# Altium schematic sheet PowerIn.SchDoc
size A4
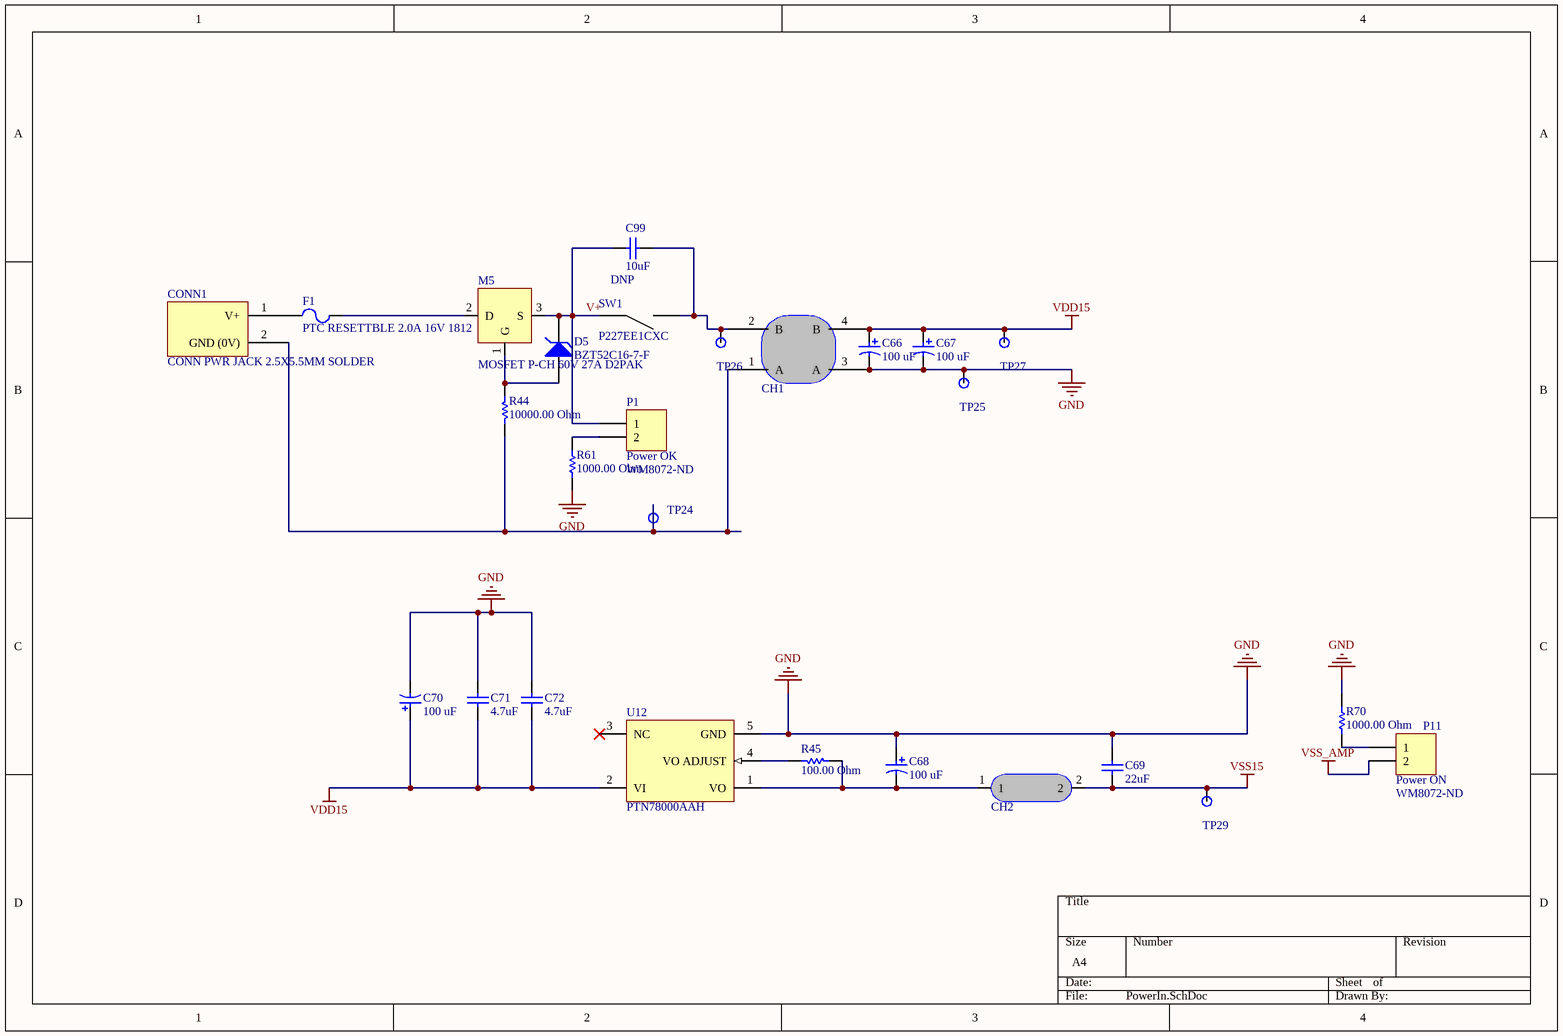
[diagram p0: PowerIn.SchDoc]

## Parts
C66  100 uF  [CAPPR55-250-1120X630X1220]
C67  100 uF  [CAPPR55-250-1120X630X1220]
C68  100 uF  [CAPPR55-250-1120X630X1220]
C69  value 22uF  [CAPC1206(3216)190_M]  (hidden comment: CAP 22uF 25V 1206(3216))
C70  100 uF  [CAPPR55-250-1120X630X1220]
C71  value 4.7uF  [CAPC0805(2012)145_L]  (hidden comment: CAP 4.7uF 25V 0805(2012))
C72  value 4.7uF  [CAPC0805(2012)145_L]  (hidden comment: CAP 4.7uF 25V 0805(2012))
C99  value 10uF  OPTION: DNP  [CAPC1206(3216)190_L]  (hidden comment: CAP 10uF 25V 1206(3216))
CH1  10uH 2.4A COMMON CHOKE  [10uH 2.4A COMMON CHOKE]  (value not drawn)
CH2  FIXED IND 10UH 5A 25 MOHM SMD  [FIXED IND 10UH 5A 190 MOHM SMD]  (value not drawn)
CONN1  CONN PWR JACK 2.5X5.5MM SOLDER  [CONN PWR JACK 2.5X5.5MM SOLDER]
D5  BZT52C16-7-F  [DIOD-SOD123-2_V]
F1  PTC RESETTBLE 2.0A 16V 1812  [TC RESETTBLE 2.0A 16V 1812]
M5  MOSFET P-CH 60V 27A D2PAK  [DPAK228P1525X483-3N]
P1  Power OK  Supplier Part Number 1: WM8072-ND  [HDR1X2]
P11  Power ON  Supplier Part Number 1: WM8072-ND  [HDR1X2]
R44  value 10000.00 Ohm  [RESC0603(1608)_N]  (hidden comment: 10K 5% 0603(1608))
R45  value 100.00 Ohm  [RESC0603(1608)_M]  (hidden comment: 100R 1% 0603(1608))
R61  value 1000.00 Ohm  [RESC0603(1608)_L]  (hidden comment: 1K 5% 0603(1608))
R70  value 1000.00 Ohm  [RESC0603(1608)_L]  (hidden comment: 1K 5% 0603(1608))
SW1  P227EE1CXC  [P227EE1CXC]
TP24  Testpoint  [0603 PROBE PAD]  (value not drawn)
TP25  Testpoint  [0603 PROBE PAD]  (value not drawn)
TP26  Testpoint  [0603 PROBE PAD]  (value not drawn)
TP27  Testpoint  [0603 PROBE PAD]  (value not drawn)
TP29  Testpoint  [0603 PROBE PAD]  (value not drawn)
U12  PTN78000AAH  [EUS0005A]

## Nets
GND: C66.2 C67.2 C68.1 C69.2 C70.2 C71.1 C72.1 CH1.3(A) R61.2 R70.1 TP25.0 U12.5(GND)
VDD15: C66.1 C67.1 C70.1 C71.2 C72.2 CH1.4(B) TP27.0 U12.2(VI)
VSS15: C69.1 CH2.2 TP29.0
VSS_AMP: P11.2
V+: C99.2 D5.2(K) M5.3(S) P1.1 SW1.1
NetC68_2: C68.2 CH2.1 R45.1 U12.1(VO)
NetC99_1: C99.1 CH1.2(B) SW1.2 TP26.0
NetCH1_1: CH1.1(A) CONN1.2(GND_(0V)) R44.1 TP24.0
NetCONN1_1: CONN1.1(V+) F1.1
NetD5_1: D5.1(A) M5.1(G) R44.2
NetF1_2: F1.2 M5.2(D)
NetP1_2: P1.2 R61.1
NetP11_1: P11.1 R70.2
NetR45_2: R45.2 U12.4(VO_ADJUST)

Not connected (* = marked no-connect by the designer): U12 3(NC)*

## Library data of the parts
C66-C68 C70 = CMP-1665-00015-4: Aluminum Electrolytic Capacitor (Radial Lead Type), 100 uF, 35 V, -40 to 85 degC, 2-Pin THD, RoHS, Bulk; Manufacturer: Panasonic; Voltage Rating: 35 V; PackageReference: Radial; ComponentLink2URL: http://industrial.panasonic.com/cdbs/www-data/pdf/RDF0000/ABA0000C1047.pdf; DatasheetVersion: 03/2016; REACH SVHC: No SVHC; Mounting Technology: Through Hole; ComponentLink2Description: Datasheet; Packaging: Bulk; Lead Pitch: 2.5 mm; Height: 11.2 mm; Pins: 2; RoHSCompliant: true; Mount: Through Hole; Package Quantity: 200; Min Operating Temperature: -40 degC; Max Operating Temperature: 85 degC; PackageDescription: 2-Pin Through Hole Device, Dia 6.3 mm, Body Length 11.2 mm; ComponentLink1Description: Manufacturer URL; Length: 11.2 mm; ComponentLink1URL: http://www.panasonic.com/
C69 = CMP-1037-04995-1: CAP 22uF 25V ±20% 1206 (3216 Metric) Thickness 1.9mm SMD; Case-EIA: 1206; Tolerance: Â±20%; Case-Metric: 3216; Rated Voltage: 25 V; Technology: SMT; Max Thickness: 1.9 mm; OrderURL: http://www.digikey.ie/product-detail/en/taiyo-yuden/TMK316BBJ226ML-T/587-3246-1-ND/3660105; Supplier Part Number 1: 587-3246-1-ND; Supplier 1: Digi-Key
C71 C72 = CMP-1036-04895-1: CAP 4.7uF 25V ±10% 0805 (2012 Metric) Thickness 1.45mm SMD; Case-Metric: 2012; Case-EIA: 0805; Tolerance: Â±10%; Technology: SMT; Rated Voltage: 25 V; Max Thickness: 1.45 mm
C99 = CMP-1037-04979-1: CAP 10uF 25V ±10% 1206 (3216 Metric) Thickness 1.9mm SMD; Case-EIA: 1206; Tolerance: Â±10%; Case-Metric: 3216; Rated Voltage: 25 V; Technology: SMT; Max Thickness: 1.9 mm; OrderURL: http://www.digikey.ie/product-detail/en/murata-electronics-north-america/GRM319R61E106KA12D/490-5525-1-ND/2334921; Supplier 1: Digi-Key; Supplier Part Number 1: 490-5525-1-ND
CH1 = 10uH 2.4A COMMON CHOKE: CMC 10UH 2.25A 2LN 9 KOHM SMD; Manufacturer: Wurth Electronics Inc.; Manufacturer Part Number: 744282100; Filter Type: Power, Signal Line; Number of Lines: 2; Impedance @ Frequency: 9 kOhm @ 100kHz; Inductance @ Frequency: 10µH @ 100kHz; DC Resistance (DCR) (Max): 50 mOhm; Voltage Rating - DC: 80V; Value: 1K; Published: 8-Jun-2000; LatestRevisionDate: 29-May-2009; LatestRevisionNote: IPC-7351 Footprint Added.; PackageReference: J1-0603; Publisher: Altium Limited; PackageDescription: Chip Resistor; RoHS: RoHS Compliant; Category: Filters; Packaging: Cut Tape (CT); Part Status: Active; Current Rating (Max): 2.25A; Voltage Rating - AC: -; Operating Temperature: -40°C ~ 125°C; Ratings: -; Approvals: -; Features: -; Mounting Type: Surface Mount; Size / Dimension: 0.492" L x 0.492" W (12.50mm x 12.50mm); Height (Max): 0.256" (6.50mm); Package / Case: Horizontal, 4 PC Pad; ComponentLink1URL: http://katalog.we-online.de/pbs/datasheet/744282100.pdf; ComponentLink1Description: http://katalog.we-online.de/pbs/datasheet/744282100.pdf; Supplier 1: Digi-Key; Supplier Part Number 1: 732-2966-1-ND; Stock 1: 0; Pricing 1: 1=3.82, 10=3.702, 50=3.3436, 100=3.2242, 250=2.9854 (EUR)
CH2 = 74477110: Manufacturer: Wurth Electronics Inc.; Material - Core: Ferrite; Inductance: 10µH; Tolerance: ±20%; Current - Saturation: 5.5A; Shielding: Shielded; DC Resistance (DCR): 25 mOhm Max; Frequency - Self Resonant: 21.5MHz; Frequency - Test: 1kHz; Value: 1K; Published: 8-Jun-2000; LatestRevisionDate: 29-May-2009; LatestRevisionNote: IPC-7351 Footprint Added.; PackageReference: J1-0603; Publisher: Altium Limited; PackageDescription: Chip Resistor; Manufacturer Part Number: 74477110; RoHS: RoHS Compliant; Category: Inductors, Coils, Chokes; Packaging: Cut Tape (CT); Part Status: Active; Type: Wirewound; Current Rating: 5A; Q @ Freq: -; Ratings: -; Operating Temperature: -40°C ~ 125°C; Mounting Type: Surface Mount; Package / Case: Nonstandard; Supplier Device Package: -; Size / Dimension: 0.472" L x 0.472" W (12.00mm x 12.00mm); Height - Seated (Max): 0.236" (6.00mm); ComponentLink1URL: http://katalog.we-online.de/pbs/datasheet/74477110.pdf; ComponentLink1Description: http://katalog.we-online.de/pbs/datasheet/74477110.pdf; Supplier 1: Digi-Key; Supplier Part Number 1: 732-1208-1-ND; Stock 1: 3817; Pricing 1: 1=2.82, 10=2.47, 50=2.2934, 100=2.2052, 250=2.11692 (EUR)
CONN1 = RAPC712X: Manufacturer: Switchcraft Inc.; Gender: Male; Industry Recognized Mating Diameter: 2.50mm ID (0.098"), 5.50mm OD (0.217"); Actual Diameter: 0.098" (2.50mm ID), 0.248" (6.30mm OD); Number of Positions/Contacts: 2 Conductors, 3 Contacts; Internal Switch(s): Single Switch, Normally Closed; Shielding: Unshielded; Current Rating: 5A; Includes: 1 pc - 1 Connector; Body Color: Black; Value: 1K; Published: 8-Jun-2000; LatestRevisionDate: 29-May-2009; LatestRevisionNote: IPC-7351 Footprint Added.; PackageReference: J1-0603; Publisher: Altium Limited; PackageDescription: Chip Resistor; Manufacturer Part Number: RAPC712X; RoHS: RoHS Compliant; Category: Connectors, Interconnects; Packaging: Bulk; Part Status: Active; Connector Type: Jack; Mounting Type: Through Hole, Right Angle; Mounting Feature: -; Termination: Solder Eyelet(s); Features: -; Insulation Color: -; Voltage - Rated: -; Mating Length/Depth: -; Contact Material - Plating: Silver; Body Material: -; Operating Temperature: -; Housing Material: Thermoplastic; Contact Material: Brass; Thread Size: -; Material Flammability Rating: -; Ingress Protection: -; ComponentLink1URL: http://www.switchcraft.com/Drawings/rapc712x_cd.pdf; ComponentLink1Description: http://www.switchcraft.com/Drawings/rapc712x_cd.pdf; Supplier 1: Digi-Key; Supplier Part Number 1: SC237-ND; Stock 1: 19155; Pricing 1: 1=0.85, 10=0.786, 25=0.7416, 50=0.719, 100=0.6852, 250=0.674, 500=0.6608 (EUR)
D5 = CMP-0860-00001-1: Surface Mount Zener Diode, 16 V, -65 to 125 degC, SOD123, RoHS, Tape and Reel; Manufacturer: Diodes Inc; Maximum Reverse Current: 0.1 uA; Tol V: 5.56% Typ.; Maximum Zener Impedance f: 1 kHz ZZK=200 Ohm; Voltage Zener: 16 V Typ.; Power Max: 500 mW; ComponentLink2URL: http://www.diodes.com/datasheets/ds18004.pdf; PackageDescription: 2-Pin SOD123, Body 2.7 x 1.55 mm, Height 1.45 mm; ComponentLink3Description: Package Specification; Mounting Technology: Surface Mount; PackageReference: SOD123; ComponentLink2Description: Datasheet; RoHS: TRUE; ComponentLink3URL: http://www.diodes.com/datasheets/ap02002.pdf; Operating Temperature: -65 to 150 degC; DatasheetVersion: Rev. 37-2; Packing: Tape and Reel; ComponentLink1Description: Manufacturer URL; ComponentLink1URL: http://www.diodes.com/; PackageVersion: Rev. 79; PartNumber: BZT52C16-7-F
F1 = TC RESETTBLE 2.0A 16V 1812: Manufacturer: Bel Fuse Inc.; Manufacturer Part Number: 0ZCG0200AF2B; Type: Polymeric; Current - Max: 100A; Current - Hold (Ih) (Max): 2A; Current - Trip (It): 3.5A; Time to Trip: 5s; Resistance - Initial (Ri) (Min): 20 mOhm; Resistance - Post Trip (R1) (Max): 85 mOhm; Approvals: cURus, TUV; Value: 1K; Published: 8-Jun-2000; LatestRevisionDate: 29-May-2009; LatestRevisionNote: IPC-7351 Footprint Added.; PackageReference: J1-0603; Publisher: Altium Limited; PackageDescription: Chip Resistor; RoHS: RoHS Compliant; Category: Circuit Protection; Packaging: Cut Tape (CT); Part Status: Active; Voltage - Max: 16V; Resistance - 25°C (Typ): -; Operating Temperature: -40°C ~ 85°C; Ratings: -; Mounting Type: Surface Mount; Package / Case: 1812 (4532 Metric), Concave; Size / Dimension: 0.179" L x 0.128" W (4.55mm x 3.24mm); Height - Seated (Max): -; Thickness (Max): 0.051" (1.30mm); Lead Spacing: -; ComponentLink1URL: http://www.belfuse.com/pdfs/0ZCG.pdf; ComponentLink1Description: http://www.belfuse.com/pdfs/0ZCG.pdf; Supplier 1: Digi-Key; Supplier Part Number 1: 507-2074-1-ND; Stock 1: 3479; Pricing 1: 1=0.24, 5=0.23, 10=0.221, 50=0.1972, 100=0.1835, 250=0.16312, 500=0.13594 (EUR)
M5 = MOSFET P-CH 60V 27A D2PAK: Manufacturer: Fairchild/ON Semiconductor; Manufacturer Part Number: FQB27P06TM; FET Type: P-Channel; Current - Continuous Drain (Id) @ 25°C: 27A (Tc); Drive Voltage (Max Rds On,  Min Rds On): 10V; Vgs(th) (Max) @ Id: 4V @ 250µA; Gate Charge (Qg) (Max) @ Vgs: 43nC @ 10V; Input Capacitance (Ciss) (Max) @ Vds: 1400pF @ 25V; Vgs (Max): ±25V; Power Dissipation (Max): 3.75W (Ta), 120W (Tc); Rds On (Max) @ Id, Vgs: 70 mOhm @ 13.5A, 10V; Value: 1K; Published: 8-Jun-2000; LatestRevisionDate: 29-May-2009; LatestRevisionNote: IPC-7351 Footprint Added.; PackageReference: J1-0603; Publisher: Altium Limited; PackageDescription: Chip Resistor; RoHS: RoHS Compliant; Category: Discrete Semiconductor Products; Packaging: Cut Tape (CT); Part Status: Active; Technology: MOSFET (Metal Oxide); Drain to Source Voltage (Vdss): 60V; FET Feature: -; Operating Temperature: -55°C ~ 175°C (TJ); Mounting Type: Surface Mount; Supplier Device Package: D²PAK (TO-263AB); Package / Case: TO-263-3, D²Pak (2 Leads + Tab), TO-263AB; ComponentLink1URL: https://www.fairchildsemi.com/datasheets/FQ/FQB27P06.pdf; ComponentLink1Description: https://www.fairchildsemi.com/datasheets/FQ/FQB27P06.pdf; Supplier 1: Digi-Key; Supplier Part Number 1: FQB27P06TMCT-ND; Stock 1: 4647; Pricing 1: 1=1.58, 10=1.406, 100=1.0959 (EUR)
P1 P11 = Header 2: Header, 2-Pin; Manufacturer: Molex, LLC; Manufacturer Part Number: 0901200122; Connector Type: Header, Breakaway; Pitch - Mating: 0.100" (2.54mm); Shrouding: Unshrouded; Number of Positions: 2; Number of Positions Loaded: All; Contact Length - Mating: 0.266" (6.75mm); LatestRevisionDate: 17-Jul-2002; LatestRevisionNote: Re-released for DXP Platform.; Publisher: Altium Limited; Supplier 1: Digi-Key; RoHS: RoHS Compliant; Category: Connectors, Interconnects; Stock 1: 16114; Pricing 1: 1=0.37, 10=0.358, 25=0.3064, 50=0.2604, 100=0.2502, 250=0.22468, 500=0.21448, 1000=0.17874 (EUR); Packaging: Bulk; Part Status: Active; Contact Type: Male Pin; Number of Rows: 1; Row Spacing - Mating: -; Mounting Type: Through Hole; Termination: Solder; Fastening Type: -; Features: -; Contact Finish - Mating: Tin; Contact Finish Thickness - Mating: 118.1µin (3.00µm); Insulation Color: Black; Ingress Protection: -; ComponentLink1URL: http://www.molex.com/pdm_docs/sd/901200122_sd.pdf; ComponentLink1Description: http://www.molex.com/pdm_docs/sd/901200122_sd.pdf
R44 = CMP-1012-00098-1: 10K 0.1W 5% 0603 (1608 Metric)  SMD; Case-EIA: 0603; Case-Metric: 1608; Technology: SMT; Tolerance: 5 %; Power: 0.1 W; OrderURL: http://www.digikey.ie/product-detail/en/yageo/RC0603JR-0710KL/311-10KGRCT-ND/729647; Supplier 1: Digi-Key; Supplier Part Number 1: 311-10KGRCT-ND
R45 = CMP-1012-00397-1: 100R 0.1W 1% 0603 (1608 Metric)  SMD; Case-EIA: 0603; Case-Metric: 1608; Technology: SMT; Tolerance: 1 %; Power: 0.1 W
R61 R70 = CMP-1012-00074-1: 1K 0.1W 5% 0603 (1608 Metric)  SMD; Case-EIA: 0603; Case-Metric: 1608; Technology: SMT; Tolerance: 5 %; Power: 0.1 W; OrderURL: http://www.digikey.ie/product-detail/en/yageo/RC0603JR-071KL/311-1.0KGRCT-ND/729624; Supplier 1: Digi-Key; Supplier Part Number 1: 311-1.0KGRCT-ND
SW1 = P227EE1CXC: SWITCH PUSHBUTTON DPST 7A 125V; Manufacturer: E-Switch; Switch Function: Off-On; Current Rating: 7A (AC); Actuator Type: Plunger for Cap; Color - Actuator/Cap: Blue; Electrical Life: 6,000 Cycles; Value: 1K; Published: 8-Jun-2000; LatestRevisionDate: 29-May-2009; LatestRevisionNote: IPC-7351 Footprint Added.; PackageReference: J1-0603; Publisher: Altium Limited; PackageDescription: Chip Resistor; Manufacturer Part Number: P227EE1CXC; RoHS: RoHS Compliant; Category: Switches; Packaging: Bulk; Part Status: Active; Type: Standard; Circuit: DPST; Voltage Rating - AC: 125V; Voltage Rating - DC: -; Illumination Type, Color: -; Illumination Voltage (Nominal): -; Mounting Type: Through Hole, Right Angle; Termination Style: PC Pin; Ingress Protection: -; Features: -; Panel Cutout Dimensions: -; Operating Temperature: -20°C ~ 85°C; Mechanical Life: -; ComponentLink1URL: http://media.digikey.com/pdf/Data%20Sheets/E-Switch%20PDFs/P227EE1CXC_Dwg.pdf; ComponentLink1Description: http://media.digikey.com/pdf/Data%20Sheets/E-Switch%20PDFs/P227EE1CXC_Dwg.pdf; Supplier 1: Digi-Key; Supplier Part Number 1: EG1026-ND; Stock 1: 1567; Pricing 1: 1=2.23, 10=2.076, 25=1.9768, 50=1.878, 100=1.8285, 250=1.77908, 500=1.68022, 1000=1.58139, 5000=1.3343 (EUR)
TP24-TP27 TP29 = Testpoint: 0.063" x 0.031" x 0.045" (1.60mm x 0.80mm x 1.15mm); OrderURL: http://www.digikey.ie/product-detail/en/te-connectivity-amp-connectors/RCU-0C/A106145CT-ND/3477802; Value: *; Width: 0.8; Height: 1.15mm; Length: 1.60mm; Supplier Part Number 1: A106145CT-ND; Supplier 1: Digi-Key
U12 = CMP-0387-00611-2: 1.5 A, Wide Input, Non-Isolated, Wide Negative Output Adjust Module, -40 to 85 degC, 5-pin Module (EUS5), Pb-Free (RoHS); Manufacturer: Texas Instruments; VO Adjustable: TRUE; Vin(Max)(V): 29; Vout(Max)(V): -3; Regulated Outputs(#): 1; Iout(Max)(A): 1.5; SubFamily: Buck/Boost & Negative Output Module; Vout(Min)(V): -15; Vin(Min)(V): 7; ComponentLink4Description: URL Link1; PartNumber: PTN78000AAH; ComponentLink3URL: http://www.ti.com/litv/pdf/mpds139b; ComponentLink3Description: Package Specification; PackageDescription: 5-Pin Plastic Special Shape, Body 12.57 x 18.92 mm; PackageReference: EUS0005A; DatasheetVersion: SLTS246B; Mounting Technology: Through Hole; ComponentLink2URL: http://www.ti.com/general/docs/lit/getliterature.tsp?genericPartNumber=PTN78000A&fileType=pdf; Eco-Plan: Pb-Free (RoHS); ComponentLink2Description: Datasheet; ComponentLink1Description: Manufacturer URL; PackageVersion: 4204990-2/C; ComponentLink1URL: http://www.ti.com/; ComponentLink4URL: Samples URL:http://www.ti.com/product/ptn78000a#samples